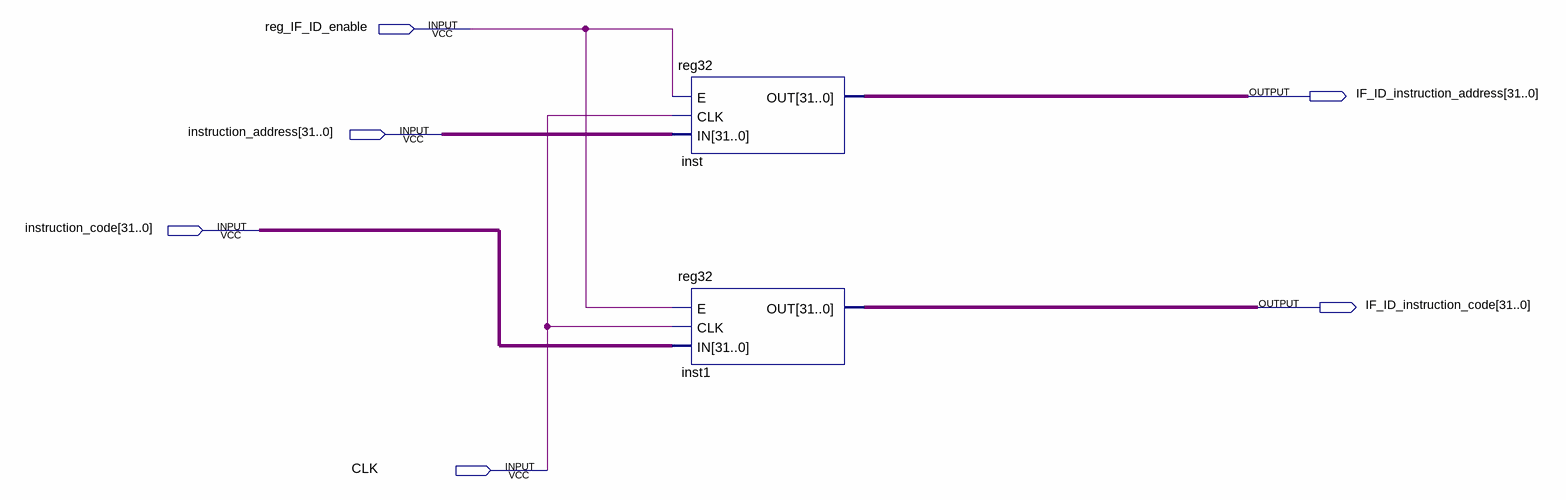
[diagram p0: schematic sheet]
// Quartus schematic reg_IF-ID.bdf as structural Verilog: 2 symbols, 6 pins
module \reg_IF-ID  (
  input  reg_IF_ID_enable,
  input  [31:0] instruction_address,
  input  [31:0] instruction_code,
  input  CLK,
  output [31:0] IF_ID_instruction_address,
  output [31:0] IF_ID_instruction_code
);

  reg32 inst (.E(reg_IF_ID_enable), .CLK(CLK), .IN(instruction_address), .OUT(IF_ID_instruction_address));
  reg32 inst1 (.E(reg_IF_ID_enable), .CLK(CLK), .IN(instruction_code), .OUT(IF_ID_instruction_code));
endmodule
